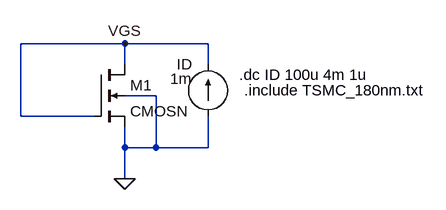
[diagram p0: schematic 4l.asc]
4l.asc, the LTspice schematic file:
Version 4
SHEET 1 880 680
WIRE 416 240 256 240
WIRE 544 240 416 240
WIRE 416 272 416 240
WIRE 544 272 544 240
WIRE 464 320 416 320
WIRE 256 352 256 240
WIRE 368 352 256 352
WIRE 416 400 416 368
WIRE 464 400 464 320
WIRE 464 400 416 400
WIRE 544 400 544 352
WIRE 544 400 464 400
WIRE 416 448 416 400
FLAG 416 448 0
FLAG 416 240 VGS
SYMBOL nmos4 368 272 R0
SYMATTR InstName M1
SYMATTR Value2 l=0.18u w=4u ad=1.8p as=1.8p pd=8.9u ps=8.9u
SYMATTR Value CMOSN
SYMBOL current 544 352 R180
WINDOW 0 24 80 Left 2
WINDOW 3 24 58 Left 2
SYMATTR InstName ID
SYMATTR Value 1m
TEXT 592 288 Left 2 !.dc ID 100u 4m 1u
TEXT 600 312 Left 2 !.include TSMC_180nm.txt

The netlist it stands for:
* 4l.asc
M1 VGS VGS 0 0 CMOSN l=0.18u w=4u ad=1.8p as=1.8p pd=8.9u ps=8.9u
ID 0 VGS 1m
.model NMOS NMOS
.model PMOS PMOS
.lib standard.mos
.dc ID 100u 4m 1u
.include TSMC_180nm.txt
.backanno
.end